# Altium schematic sheet 33. USB 3.0 TYPE A CONN#2.SchDoc: USB 3.0 TYPE-A CONNECTORS - 2
size 513 x 386 mm; Project: PROC154E2(001)_SK_AM69; Issue: 1.0; RevCode: E3; Page Create Date: March  8, 1995; Variant Name: Core Design; Schematic Page Number: 33; Page Number: 33; Page Size: C; Comment: MISTRAL_TITLEBLK_CSIZE_1; Page Count: 62; Schematic Page Count: 62; Name: PROC154E2 001 SK AM69; DsnPath: C:\Users\danie\Downloads\sprr466c\PROC154E3_RP\PROC154E3_SCH.DSN; SchematicName: SCHEMATIC1; PageName: 33. USB 3.0 TYPE A CONN#2; PageSize: C; TopSchematic: True
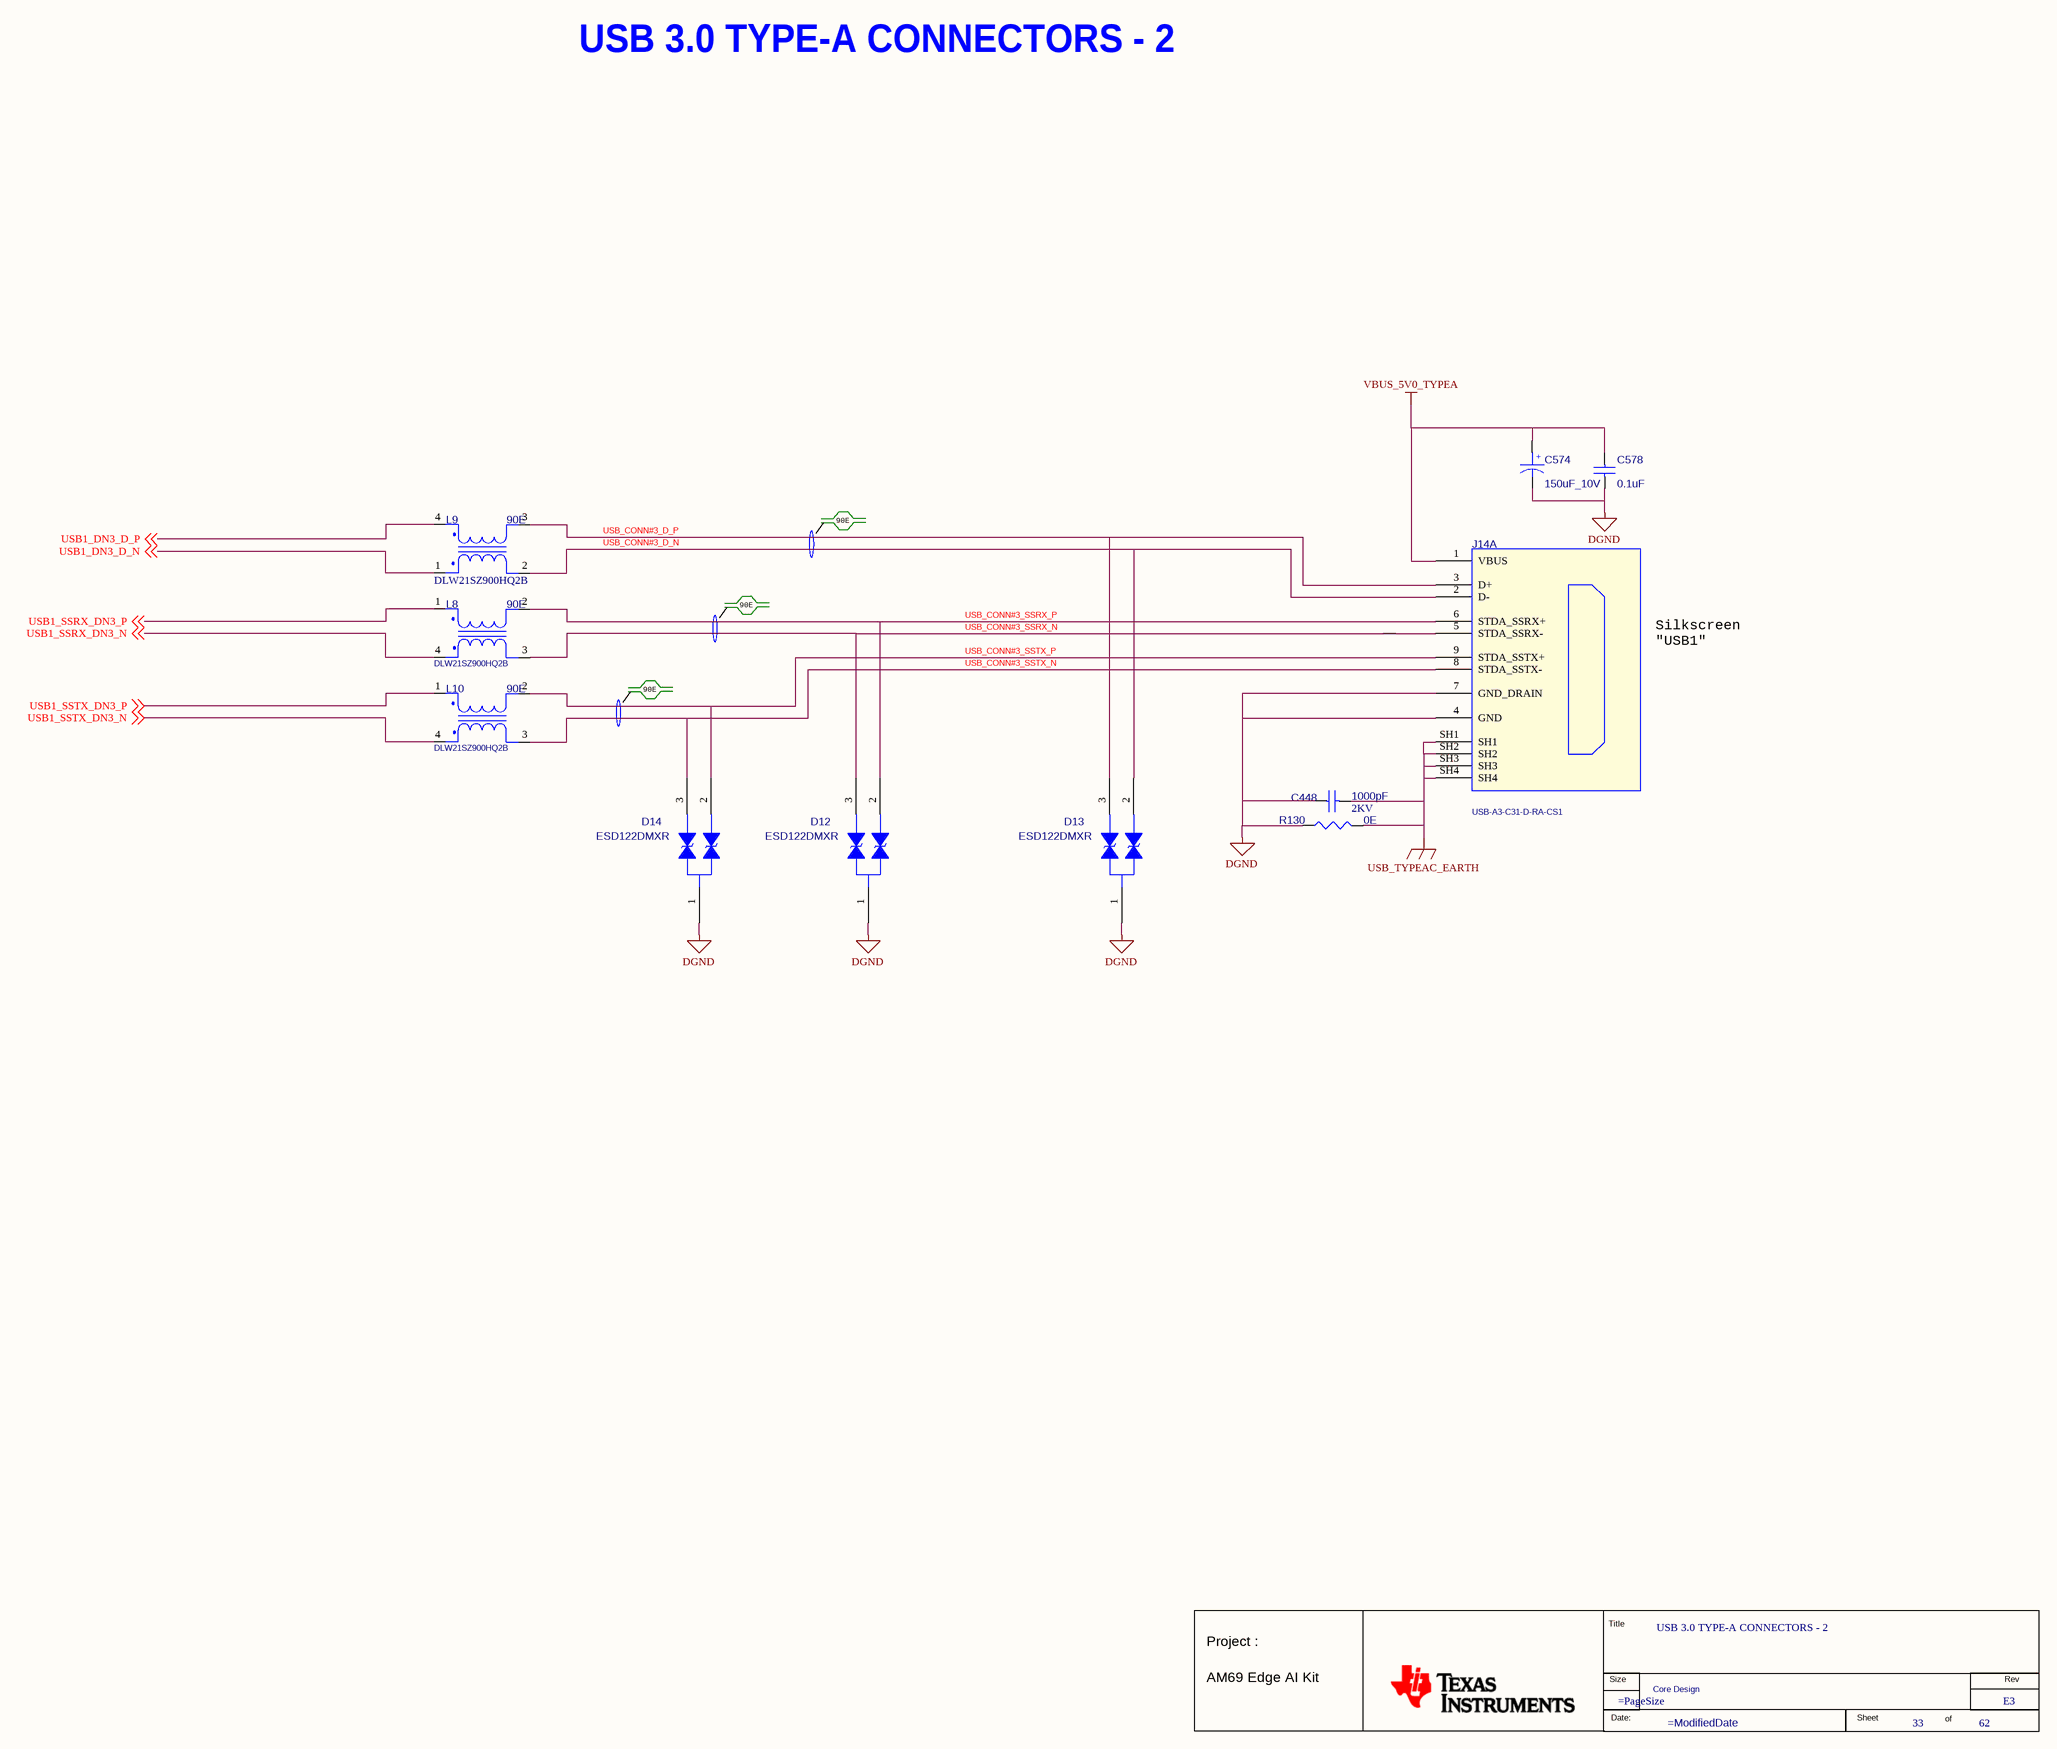
[diagram p0: 33. USB 3.0 TYPE A CONN#2.SchDoc]

## Parts
*  RevCode: E3  Title: USB 3.0 TYPE-A CONNECTORS - 2  Page Number: 33  Page Count: 62  Variant Name: Core Design  (hidden comment: MISTRAL_TITLEBLK_CSIZE_1)  (graphical)
C448  1000pF  Voltage: 2KV  [CAP1206_1-5]
C574  150uF_10V  [CAPT3528B_2-25]
C578  0.1uF  [CAP0201_0-5]
D12  ESD122DMXR  [X2SON3_ESD122DMX_30X40_0-4]
D13  ESD122DMXR  [X2SON3_ESD122DMX_30X40_0-4]
D14  ESD122DMXR  [X2SON3_ESD122DMX_30X40_0-4]
J14  Mfr_part_number: USB-A3-C31-D-RA-CS1  [CON_USBAC33_USB-A3-C31-D-RA-CS1_S_R_T_15-9]  (hidden comment: CON_USB-A9-C24_F)  (part A of 2)
L8  90E  Mfr_part_number: DLW21SZ900HQ2B  [IND4_DLW21H_90X60_SMD_1-4]
L9  90E  Mfr_part_number: DLW21SZ900HQ2B  [IND4_DLW21H_90X60_SMD_1-4]
L10  90E  Mfr_part_number: DLW21SZ900HQ2B  [IND4_DLW21H_90X60_SMD_1-4]
R130  0E  [RES0805_0-75]

## Nets
DGND: C448.1 C574.2 C578.2 D12.1(GND) D13.1(GND) D14.1(GND) J14.4(GND) J14.7(GND_DRAIN) R130.1
USB_TYPEAC_EARTH: C448.2 J14.SH1 J14.SH2 J14.SH3 J14.SH4 R130.2
VBUS_5V0_TYPEA: C574.1 C578.1 J14.1(VBUS)
USB1_DN3_D_N: L9.1(IN1) ; off-sheet USB1_DN3_D_N
USB1_DN3_D_P: L9.4(OUT2) ; off-sheet USB1_DN3_D_P
USB1_SSRX_DN3_N: L8.4(OUT2) ; off-sheet USB1_SSRX_DN3_N
USB1_SSRX_DN3_P: L8.1(IN1) ; off-sheet USB1_SSRX_DN3_P
USB1_SSTX_DN3_N: L10.4(OUT2) ; off-sheet USB1_SSTX_DN3_N
USB1_SSTX_DN3_P: L10.1(IN1) ; off-sheet USB1_SSTX_DN3_P
USB_CONN#3_D_N: D13.2(IO1) J14.2(D-) L9.2(IN2)
USB_CONN#3_D_P: D13.3(IO2) J14.3(D+) L9.3(OUT1)
USB_CONN#3_SSRX_N: D12.3(IO2) J14.5(STDA_SSRX-) L8.3(OUT1)
USB_CONN#3_SSRX_P: D12.2(IO1) J14.6(STDA_SSRX+) L8.2(IN2)
USB_CONN#3_SSTX_N: D14.3(IO2) J14.8(STDA_SSTX-) L10.3(OUT1)
USB_CONN#3_SSTX_P: D14.2(IO1) J14.9(STDA_SSTX+) L10.2(IN2)

## Notes on the sheet
- USB 3.0 TYPE-A CONNECTORS - 2
- 90E
- Silkscreen
  "USB1"
- (in symbol CAP_POL) +
- (in symbol MISTRAL_TITLEBLK_CSIZE_1) Title; Project :; Size; Rev; AM69 Edge AI Kit; Date:; Sheet; of

## Library data of the parts
* = MISTRAL_TITLEBLK_CSIZE_1: Issue: 1.0; Project: PROC154E2(001)_SK_AM69; Name: PROC154E2 001 SK AM69; Page Create Date: March  8, 1995; Page Size: =PageSize; Page Modify Date: =ModifiedDate; Schematic Page Count: 62; Schematic Page Number: 33
C448 = CAP_Dup1: CAP CERAMIC 1000pF 2KV 10% X7R 1206; Part Reference: C448; Automotive Alternate_mfr_part_number: C1206X102KGRACAUTO; Automotive Alternate_mfr_name: KEMET; Direct Alternate_mfr_part_number: C1206C102KGRACTU; Part_type: CAPACITORS\CERAMIC; Mistral Part No: 120015110005-R; Wattage: NA; Custom_Duty: 15%; Customs_HS_Code: 85322990; Project: MANTIS_1.0_BRD; Value: 1000pF; PCB Footprint: CAP1206_1-5; Direct Alternate_mfr_name: KEMET; MECHANICAL 3D STEP FILE: CAP1206_1-5; Chkd/date: MANIRAJA/111219; Crtd /date: ALVY/111219; Datasheet: Y:\MIS_DATABASE\DATASHEETS\CAPACITORS\KEMET-C-X7R-HV.PDF; Temperature: -55°C+125°C; Weight: 16.2mg; Height: 1.35MM; Distributor_part_number: 399-4819-1-ND; Distributor_name: DIGIKEY; Package: 1206; Tolerance: 10%; Mfr_part_number: C1206C102KGRACTU; Mfr_name: KEMET; Library Ref: CAP; Footprint Ref: CAP1206_1-5; Library Path: Y:\MIS_DATABASE\Library\ALTIUM_TOOL\SCHEMATICS_PARTS\MS_DISCRETE_Library.schlib; Footprint Path: Y:\MIS_DATABASE\Library\ALTIUM_TOOL\PCB_FOOTPRINTS\Altium_Footprint_Lib.PcbLib
C574 = CAP_POL: CAP TANTALUM 150uF 10V 20% ESR 500mE B3528; Part Reference: C574; Mistral Part No: 120015050001-R; Mfr_name: AVX CORPORATION; Mfr_part_number: TLJB157M010R0500; Part_type: CAPACITORS\TANTALUM; Project: MED CARD; Wattage: NA; Customs_HS_Code: 85322990; Custom_Duty: 15%; Value: 150uF_10V; PCB Footprint: CAPT3528B_2-25; Tolerance: 20%; Voltage: 10V; Package: B3528; Distributor_name: DIGIKEY; Distributor_part_number: 478-3349-1-ND; Library Ref: CAP_POL; Height: 2.10MM; Weight: NA; Temperature: -55°C+125°C; Datasheet: Y:\MIS_DATABASE\DATASHEETS\CAPACITORS\TLJ_SERIES.PDF; Crtd /date: VASANTHA/040515; Chkd/date: NAVEED/060515; MECHANICAL 3D STEP FILE: CAPT3528B_2-25; Footprint Ref: CAPT3528B_2-25; Library Path: Y:\MIS_DATABASE\Library\ALTIUM_TOOL\SCHEMATICS_PARTS\MS_DISCRETE_Library.schlib; Footprint Path: Y:\MIS_DATABASE\Library\ALTIUM_TOOL\PCB_FOOTPRINTS\Altium_Footprint_Lib.PcbLib
C578 = CAP_Dup1: CAP CERAMIC 0.1uF 16V 10% X7S AUTO 0201; Part Reference: C578; Part_type: CAPACITORS\CERAMIC; Mfr_part_number: GRT033C71C104KE01D; Mfr_name: MURATA; Mistral Part No: 120021030007-R; Custom_Duty: 15%; Customs_HS_Code: 85322990; Wattage: NA; Project: J7ES_SK_BRD; Value: 0.1uF; PCB Footprint: CAP0201_0-5; MECHANICAL 3D STEP FILE: CAP0201_0-5; Chkd/date: MANIRAJA/110321; Crtd /date: ALVY/110321; Datasheet: Y:\MIS_DATABASE\DATASHEETS\CAPACITORS\GRT033C71C104KE01.PDF; Temperature: -55°C+125°C; Weight: 330mg; Height: 0.33MM; Distributor_part_number: 490-GRT033C71C104KE01DTR-ND; Distributor_name: DIGIKEY; Package: 0201; Voltage: 16V; Tolerance: 10%
D12 = DIODE_ESD122DMXR: DIODE 2-CH ESD PROTECTION FOR USB TYPE-C AND HDMI 2.0 X2SON-3; Part Reference: D12; Part_type: DIODE\TVS; Mfr_name: TEXAS INSTRUMENTS; Mistral Part No: 130017080015-R; Custom_Duty: 15%; Customs_HS_Code: 85412900; Wattage: NA; Project: TI_SVB_CONTROLLER CARD; Value: ESD122DMXR; MECHANICAL 3D STEP FILE: X2SON3_ESD122DMX_30X40_0-4; Chkd/date: MANIRAJA/140817; Crtd /date: MANIRAJA/140817; Datasheet: Y:\MIS_DATABASE\DATASHEETS\DISCRETES\DIODES\ESD122XX.PDF; Temperature: -40°C+125°C; Weight: NA; Height: 0.40MM; Library Ref: DIODE_ESD122DMXR; Distributor_part_number: ESD122DMXR-ND; Distributor_name: DIGIKEY; Package: X2SON-3; Voltage: NA; Tolerance: NA; Mfr_part_number: ESD122DMXR; PCB Footprint: X2SON3_ESD122DMX_30X40_0-4
D13 = DIODE_ESD122DMXR: DIODE 2-CH ESD PROTECTION FOR USB TYPE-C AND HDMI 2.0 X2SON-3; Part Reference: D13; Mistral Part No: 130017080015-R; Mfr_name: TEXAS INSTRUMENTS; Part_type: DIODE\TVS; Project: TI_SVB_CONTROLLER CARD; Tolerance: NA; Customs_HS_Code: 85412900; Custom_Duty: 15%; Value: ESD122DMXR; PCB Footprint: X2SON3_ESD122DMX_30X40_0-4; Mfr_part_number: ESD122DMXR; Voltage: NA; Wattage: NA; Package: X2SON-3; Distributor_name: DIGIKEY; Distributor_part_number: ESD122DMXR-ND; Library Ref: DIODE_ESD122DMXR; Height: 0.40MM; Weight: NA; Temperature: -40°C+125°C; Datasheet: Y:\MIS_DATABASE\DATASHEETS\DISCRETES\DIODES\ESD122XX.PDF; Crtd /date: MANIRAJA/140817; Chkd/date: MANIRAJA/140817; MECHANICAL 3D STEP FILE: X2SON3_ESD122DMX_30X40_0-4
D14 = DIODE_ESD122DMXR: DIODE 2-CH ESD PROTECTION FOR USB TYPE-C AND HDMI 2.0 X2SON-3; Part Reference: D14; Part_type: DIODE\TVS; Mfr_name: TEXAS INSTRUMENTS; Mistral Part No: 130017080015-R; Custom_Duty: 15%; Customs_HS_Code: 85412900; Wattage: NA; Project: TI_SVB_CONTROLLER CARD; Value: ESD122DMXR; MECHANICAL 3D STEP FILE: X2SON3_ESD122DMX_30X40_0-4; Chkd/date: MANIRAJA/140817; Crtd /date: MANIRAJA/140817; Datasheet: Y:\MIS_DATABASE\DATASHEETS\DISCRETES\DIODES\ESD122XX.PDF; Temperature: -40°C+125°C; Weight: NA; Height: 0.40MM; Library Ref: DIODE_ESD122DMXR; Distributor_part_number: ESD122DMXR-ND; Distributor_name: DIGIKEY; Package: X2SON-3; Voltage: NA; Tolerance: NA; Mfr_part_number: ESD122DMXR; PCB Footprint: X2SON3_ESD122DMX_30X40_0-4
J14 = CON_USB-A9-C24_F: CON USB-A TYPE 9POS AND USB-C TYPE 24POS STACKED FEMALE RT TH; Part Reference: J14; Part_type: CONNECTOR\USB; Mfr_name: ADAM TECH; Mistral Part No: 150021020043-R; Custom_Duty: 24%; Customs_HS_Code: 85369090; Wattage: NA; Project: J7ES_SK_BRD; Value: CON_USB-A9-C24_F; PCB Footprint: CON_USBAC33_USB-A3-C31-D-RA-CS1_S_R_T_15-9; Footprint Path: Y:\MIS_DATABASE\Library\ALTIUM_TOOL\PCB_FOOTPRINTS\Altium_Footprint_Lib.PcbLib; Library Path: Y:\MIS_DATABASE\Library\ALTIUM_TOOL\SCHEMATICS_PARTS\MS_CONNECTOR_Library.schlib; MECHANICAL 3D STEP FILE: CON_USBAC33_USB-A3-C31-D-RA-CS1_S_R_T_15-9; Chkd/date: MANIRAJA/110221; Crtd /date: ALVY/110221; Datasheet: Y:\MIS_DATABASE\DATASHEETS\CONNECTORS\USB-A3-C31-D-RA-CS1.PDF; Temperature: -30°C+85°C; Weight: NA; Height: 15.88MM; Footprint Ref: CON_USBAC33_USB-A3-C31-D-RA-CS1_S_R_T_15-9; Library Ref: CON_USB-A9-C24_F; Distributor_part_number: 2057-USB-A3-C31-D-RA-CS1-ND; Distributor_name: DIGIKEY; Package: THRU-HOLE; Voltage: NA; Tolerance: NA
L8 = INDUCTOR_DLW31S: IND COMMON MODE CHOKE 90E 280mA SMD; Part Reference: L8; Mfr_name: MURATA; Mistral Part No: 130019060035-R; Custom_Duty: 24%; Customs_HS_Code: 85437099; Wattage: NA; Project: TI_J7ES_CP; SIGNAL_MODEL: INDUCTOR_DLW31S_IND4_DLW21H_90X_90E; Value: 90E; PCB Footprint: IND4_DLW21H_90X60_SMD_1-4; Footprint Path: Y:\MIS_DATABASE\Library\ALTIUM_TOOL\PCB_FOOTPRINTS\Altium_Footprint_Lib.PcbLib; Library Path: Y:\MIS_DATABASE\Library\ALTIUM_TOOL\SCHEMATICS_PARTS\MS_DISCRETE_Library.schlib; MECHANICAL 3D STEP FILE: IND4_DLW21H_90X60_SMD_1-4; Chkd/date: MANIRAJA/270619; Crtd /date: MANIRAJA/270619; Datasheet: Y:\MIS_DATABASE\DATASHEETS\DISCRETES\INDUCTORS\DLW21SZ900HQ2B.PDF; Temperature: -40°C+105°C; Weight: 11mg; Height: 1.40MM; Library Ref: INDUCTOR_DLW31S; Distributor_part_number: NA; Distributor_name: NA; Package: SMD; Voltage: NA; Tolerance: NA; Part_type: INDUCTOR; Footprint Ref: IND4_DLW21H_90X60_SMD_1-4
L9 = INDUCTOR_DLW31S: IND COMMON MODE CHOKE 90E 280mA SMD; Part Reference: L9; Mistral Part No: 130019060035-R; Mfr_name: MURATA; Project: TI_J7ES_CP; Tolerance: NA; Customs_HS_Code: 85437099; Custom_Duty: 24%; SIGNAL_MODEL: INDUCTOR_DLW31S_IND4_DLW21H_90X_90E; Value: 90E; PCB Footprint: IND4_DLW21H_90X60_SMD_1-4; Footprint Ref: IND4_DLW21H_90X60_SMD_1-4; Part_type: INDUCTOR; Voltage: NA; Wattage: NA; Package: SMD; Distributor_name: NA; Distributor_part_number: NA; Library Ref: INDUCTOR_DLW31S; Height: 1.40MM; Weight: 11mg; Temperature: -40°C+105°C; Datasheet: Y:\MIS_DATABASE\DATASHEETS\DISCRETES\INDUCTORS\DLW21SZ900HQ2B.PDF; Crtd /date: MANIRAJA/270619; Chkd/date: MANIRAJA/270619; MECHANICAL 3D STEP FILE: IND4_DLW21H_90X60_SMD_1-4; Library Path: Y:\MIS_DATABASE\Library\ALTIUM_TOOL\SCHEMATICS_PARTS\MS_DISCRETE_Library.schlib; Footprint Path: Y:\MIS_DATABASE\Library\ALTIUM_TOOL\PCB_FOOTPRINTS\Altium_Footprint_Lib.PcbLib
L10 = INDUCTOR_DLW31S: IND COMMON MODE CHOKE 90E 280mA SMD; Part Reference: L10; Mfr_name: MURATA; Mistral Part No: 130019060035-R; Custom_Duty: 24%; Customs_HS_Code: 85437099; Wattage: NA; Project: TI_J7ES_CP; SIGNAL_MODEL: INDUCTOR_DLW31S_IND4_DLW21H_90X_90E; Value: 90E; PCB Footprint: IND4_DLW21H_90X60_SMD_1-4; Footprint Path: Y:\MIS_DATABASE\Library\ALTIUM_TOOL\PCB_FOOTPRINTS\Altium_Footprint_Lib.PcbLib; Library Path: Y:\MIS_DATABASE\Library\ALTIUM_TOOL\SCHEMATICS_PARTS\MS_DISCRETE_Library.schlib; MECHANICAL 3D STEP FILE: IND4_DLW21H_90X60_SMD_1-4; Chkd/date: MANIRAJA/270619; Crtd /date: MANIRAJA/270619; Datasheet: Y:\MIS_DATABASE\DATASHEETS\DISCRETES\INDUCTORS\DLW21SZ900HQ2B.PDF; Temperature: -40°C+105°C; Weight: 11mg; Height: 1.40MM; Library Ref: INDUCTOR_DLW31S; Distributor_part_number: NA; Distributor_name: NA; Package: SMD; Voltage: NA; Tolerance: NA; Part_type: INDUCTOR; Footprint Ref: IND4_DLW21H_90X60_SMD_1-4
R130 = RESISTOR_Dup2: RES 0E 1/8W 5% 0805; Part Reference: R130; Part_type: RESISTORS\FIXED; Mfr_part_number: RC0805JR-070RL; Mfr_name: YAGEO AMERICA; Mistral Part No: 110009030074-R; Custom_Duty: 15%; Customs_HS_Code: 85332119; Voltage: NA; Project: ZK_BIOMETRIC; Value: 0E; Footprint Path: Y:\MIS_DATABASE\Library\ALTIUM_TOOL\PCB_FOOTPRINTS\Altium_Footprint_Lib.PcbLib; Library Path: Y:\MIS_DATABASE\Library\ALTIUM_TOOL\SCHEMATICS_PARTS\MS_DISCRETE_Library.schlib; MECHANICAL 3D STEP FILE: RES0805_0-75; Chkd/date: VASANTHA/130416; Crtd /date: JEBRAN/020316; Datasheet: Y:\MIS_DATABASE\DATASHEETS\RESISTORS\RCXXXXL-SER_MAR18.PDF; Temperature: -55°C+155°C; Weight: 5.5mg; Height: 0.60MM; Library Ref: RESISTOR; Distributor_part_number: 311-0.0ARCT-ND; Distributor_name: DIGIKEY; Package: 0805; Wattage: 1/8W; Tolerance: 5%; Footprint Ref: RES0805_0-75; PCB Footprint: RES0805_0-75